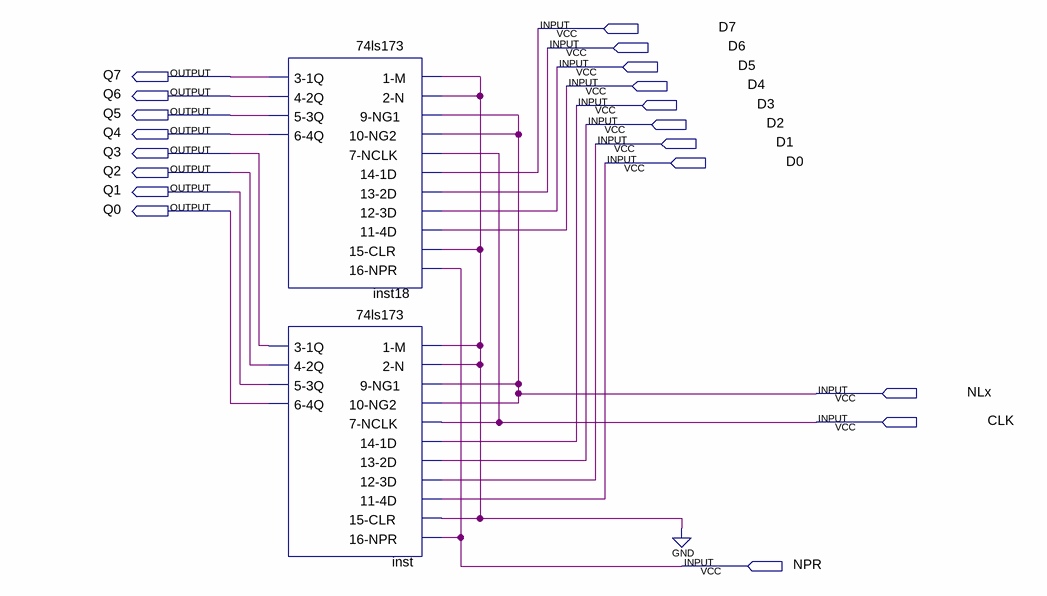
[diagram p0: schematic sheet]
// Quartus schematic AcmRegs.bdf as structural Verilog: 2 symbols, 19 pins
module AcmRegs (
  input  D7,
  input  D6,
  input  D5,
  input  D4,
  input  D3,
  input  D2,
  input  D1,
  input  D0,
  input  NLx,
  input  CLK,
  input  NPR,
  output Q7,
  output Q6,
  output Q5,
  output Q4,
  output Q3,
  output Q2,
  output Q1,
  output Q0
);

  \74ls173  inst18 (
    .\1-M (1'b0), .\2-N (1'b0), .\9-NG1 (NLx), .\10-NG2 (NLx), .\7-NCLK (CLK), .\14-1D (D7), .\13-2D (D6),
    .\12-3D (D5), .\11-4D (D4), .\15-CLR (1'b0), .\16-NPR (NPR), .\3-1Q (Q7), .\4-2Q (Q6), .\5-3Q (Q5),
    .\6-4Q (Q4));
  \74ls173  inst (
    .\1-M (1'b0), .\2-N (1'b0), .\9-NG1 (NLx), .\10-NG2 (NLx), .\7-NCLK (CLK), .\14-1D (D3), .\13-2D (D2),
    .\12-3D (D1), .\11-4D (D0), .\15-CLR (1'b0), .\16-NPR (NPR), .\3-1Q (Q3), .\4-2Q (Q2), .\5-3Q (Q1),
    .\6-4Q (Q0));
endmodule
